# Altium schematic sheet Dev.SchDoc
size 292 x 193 mm; Author: Power Lin; DocumentNumber: 3; SheetNumber: 3; SheetTotal: 4; Website: wiki-power.com
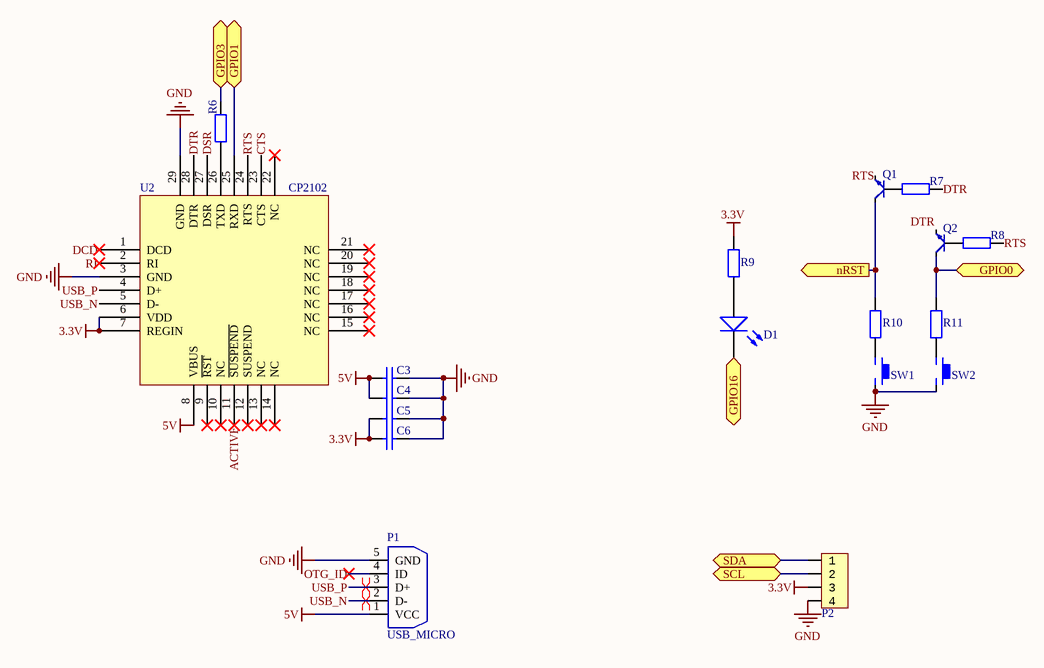
[diagram p0: Dev.SchDoc]

## Parts
C3  100nF  [CAP-0603]  (value not drawn)
C4  10uF  [CAP-0603]  (value not drawn)
C5  100nF  [CAP-0603]  (value not drawn)
C6  10uF  [CAP-0603]  (value not drawn)
D1  BLUE  [LED_0603]  (value not drawn)
P1  USB_MICRO  [MICROUSB-SOP]
P2  HDR1x4_2.54  [HDR1x4_2.54_180]  (value not drawn)
Q1  S8050  [SOT-23-3]  (value not drawn)
Q2  S8050  [SOT-23-3]  (value not drawn)
R6  470R  [R-0603]  (value not drawn)
R7  1R  [R-0603]  (value not drawn)
R8  1R  [R-0603]  (value not drawn)
R9  470R  [R-0603]  (value not drawn)
R10  470R  [R-0603]  (value not drawn)
R11  470R  [R-0603]  (value not drawn)
SW1  KEY  [KEY-4P-4.2*3.4*2.5]  (value not drawn)
SW2  KEY  [KEY-4P-4.2*3.4*2.5]  (value not drawn)
U2  CP2102  [QFN28]

## Ports
GPIO0 (bidir), GPIO1 (bidir), GPIO3 (bidir), GPIO16 (bidir), nRST (out), SCL (bidir), SDA (bidir)

## Nets
3.3V: C5.1 C6.1 P2.3 R9.2 U2.6(VDD) U2.7(REGIN)
5V: C3.1 C4.1 P1.1(VCC) U2.8(VBUS)
GND: C3.2 C4.2 C5.2 C6.2 P1.5(GND) P2.4 SW1.2 SW2.2 U2.3(GND) U2.29(GND)
ACTIVE: U2.11(~{SUSPEND})
CTS: U2.23(CTS)
DCD: U2.1(DCD)
DSR: U2.27(DSR)
DTR: Q2.2(E) R7.2 U2.28(DTR)
GPIO0: Q2.3(C) R11.2 ; port GPIO0
GPIO1: U2.25(RXD) ; port GPIO1
GPIO3: R6.2 ; port GPIO3
GPIO16: D1.K ; port GPIO16
nRST: Q1.3(C) R10.2 ; port nRST
OTG_ID: P1.4(ID)
RI: U2.2(RI)
RTS: Q1.2(E) R8.2 U2.24(RTS)
SCL: P2.2 ; port SCL
SDA: P2.1 ; port SDA
USB_N: P1.2(D-) U2.5(D-)
USB_P: P1.3(D+) U2.4(D+)
NetD1_A: D1.A R9.1
NetQ1_1: Q1.1(B) R7.1
NetQ2_1: Q2.1(B) R8.1
NetR6_1: R6.1 U2.26(TXD)
NetR10_1: R10.1 SW1.1
NetR11_1: R11.1 SW2.1

Not connected (* = marked no-connect by the designer): U2 9(~{RST})* 10(NC)* 12(SUSPEND)* 13(NC)* 14(NC)* 15(NC)* 16(NC)* 17(NC)* 18(NC)* 19(NC)* 20(NC)* 21(NC)* 22(NC)*

## Layout directives
differential pair: USB_N, USB_P

## Notes on the sheet
- Author
- DocumentName
- ModifiedDate
- ProjectName
- SheetNumber
- SheetTotal
- Website
- Revision

## Library data of the parts
C3-C6 = CAP: 贴片电容; ComponentLink1Description: 供应商链接; ComponentLink1URL: http://www.szlcsc.com/product/details_53938.html; Package: 0402; Supplier: LC; SuppliersPartNumber: C52923
D1 = LED: 发光二极管; ComponentLink1Description: 供应商链接; ComponentLink1URL: http://www.szlcsc.com/product/details_2663.html; Package: 0603; Supplier: LC; SuppliersPartNumber: C2290
P1 = USB_MICRO: USB 接口
P2 = HDR1x4_2.54: Header
Q1 Q2 = BJT_NPN: 晶体管
R6-R11 = RES: 贴片电阻; Package: 0805; Supplier: LC; SuppliersPartNumber: C17798
SW1 SW2 = KEY: 按键开关
U2 = CP2102: USB to UART